# Altium schematic sheet FINGER_PRINT.SchDoc
size A4
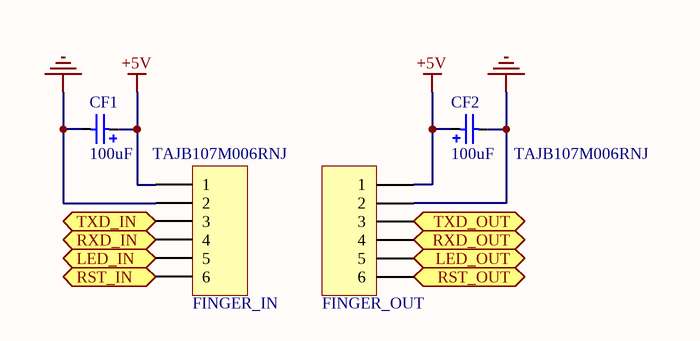
[diagram p0: FINGER_PRINT.SchDoc]

## Parts
CF1  value 100uF     TAJB107M006RNJ  [CAP_TAN_B_3518]  (hidden comment: Cap_Tan)
CF2  value 100uF     TAJB107M006RNJ  [CAP_TAN_B_3518]  (hidden comment: Cap_Tan)
FINGER_IN  Header 6  [HX2.54-6]  (value not drawn)
FINGER_OUT  Header 6  [HX2.54-6]  (value not drawn)

## Ports
LED_IN (bidir), LED_OUT (bidir), RST_IN (in), RST_OUT (in), RXD_IN (in), RXD_OUT (in), TXD_IN (out), TXD_OUT (out)

## Nets
+5V: CF1.1 CF2.1 FINGER_IN.1 FINGER_OUT.1
GND: CF1.2 CF2.2 FINGER_IN.2 FINGER_OUT.2
LED_IN: FINGER_IN.5 ; port LED_IN
LED_OUT: FINGER_OUT.5 ; port LED_OUT
RST_IN: FINGER_IN.6 ; port RST_IN
RST_OUT: FINGER_OUT.6 ; port RST_OUT
RXD_IN: FINGER_IN.4 ; port RXD_IN
RXD_OUT: FINGER_OUT.4 ; port RXD_OUT
TXD_IN: FINGER_IN.3 ; port TXD_IN
TXD_OUT: FINGER_OUT.3 ; port TXD_OUT

## Library data of the parts
CF1 CF2 = Cap_Tan: Capacitor
FINGER_IN FINGER_OUT = Header 6: Header, 6-Pin; LatestRevisionDate: 17-Jul-2002; LatestRevisionNote: Re-released for DXP Platform.; Publisher: Altium Limited